# Altium project MotorDriverWithCurrent_Project.PrjPcb
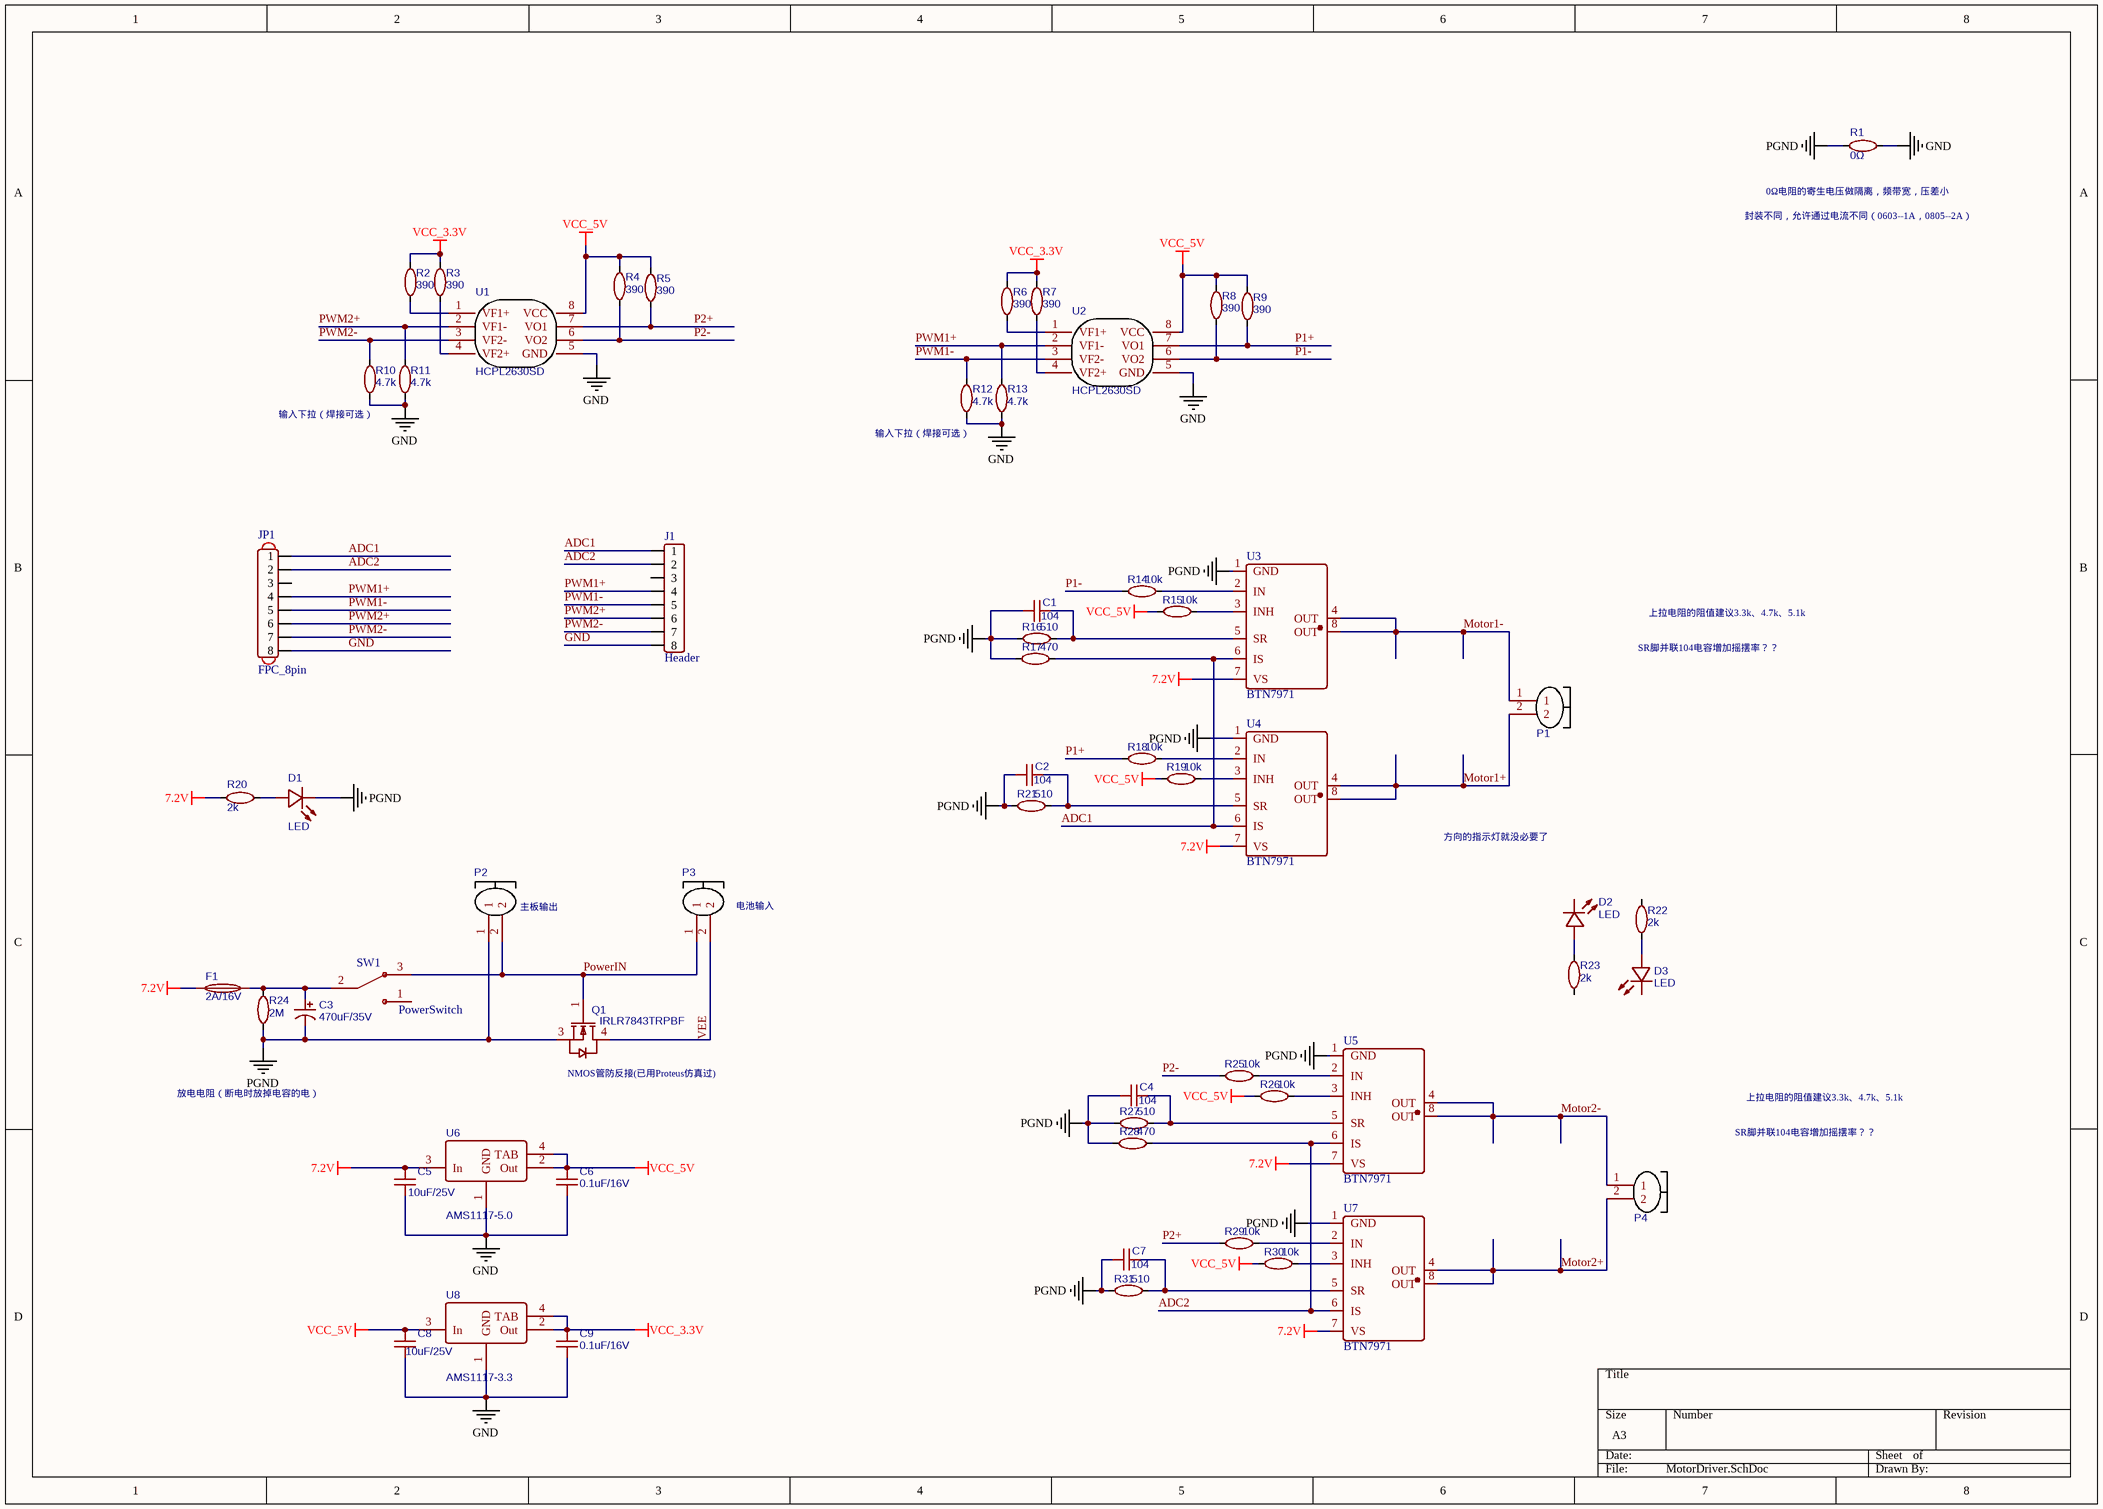
[diagram p0: MotorDriver.SchDoc]
1 sheet, 60 parts. Net scope: global (net labels, ports and power ports of the same name join across sheets).
Board file: MotorDriver.PcbDoc

## Sheet MotorDriver.SchDoc
size A3

### Parts
C1  104  [CAP_0603]
C2  104  [CAP_0603]
C3  470uF/35V  [CAPE_TH_3.5_8]
C4  104  [CAP_0603]
C5  10uF/25V  [CAP_0603]
C6  0.1uF/16V  [CAP_0603]
C7  104  [CAP_0603]
C8  10uF/25V  [CAP_0603]
C9  0.1uF/16V  [CAP_0603]
D1  LED  [LED_0603_B]
D2  LED  [LED_0603_B]
D3  LED  [LED_0603_B]
F1  2A/16V  [F1206]
J1  Header  [Header 2.54X8]
JP1  FPC_8pin  [FPC_1.0_8P]
P1  KF-2P-5.08  [KF_2P-5.08]  (value not drawn)
P2  KF-2P-5.08  [KF_2P-5.08]  (value not drawn)
P3  KF-2P-5.08  [KF_2P-5.08]  (value not drawn)
P4  KF-2P-5.08  [KF_2P-5.08]  (value not drawn)
Q1  IRLR7843TRPBF  [TO-252-2]
R1  0Ω  [RES_0805]
R2  390  [RES_0603]
R3  390  [RES_0603]
R4  390  [RES_0603]
R5  390  [RES_0603]
R6  390  [RES_0603]
R7  390  [RES_0603]
R8  390  [RES_0603]
R9  390  [RES_0603]
R10  4.7k  [RES_0603]
R11  4.7k  [RES_0603]
R12  4.7k  [RES_0603]
R13  4.7k  [RES_0603]
R14  10k  [RES_0603]
R15  10k  [RES_0603]
R16  510  [RES_0603]
R17  470  [RES_0603]
R18  10k  [RES_0603]
R19  10k  [RES_0603]
R20  2k  [RES_0603]
R21  510  [RES_0603]
R22  2k  [RES_0603]
R23  2k  [RES_0603]
R24  2M  [RES_0805]
R25  10k  [RES_0603]
R26  10k  [RES_0603]
R27  510  [RES_0603]
R28  470  [RES_0603]
R29  10k  [RES_0603]
R30  10k  [RES_0603]
R31  510  [RES_0603]
SW1  PowerSwitch  [SW-TH_K3-1260D-K1]
U1  HCPL2630SD  [SOP8_2_54]
U2  HCPL2630SD  [SOP8_2_54]
U3  BTN7971  [TO263_7]
U4  BTN7971  [TO263_7]
U5  BTN7971  [TO263_7]
U6  AMS1117-5.0  [SOT-223_3]
U7  BTN7971  [TO263_7]
U8  AMS1117-3.3  [SOT-223_3]

### Nets
7.2V: C5.1 F1.1 R20.1 U3.7(VS) U4.7(VS) U5.7(VS) U6.3(In) U7.7(VS)
GND: C5.2 C6.2 C8.2 C9.2 J1.8 JP1.8 R1.1 R10.1 R11.1 R12.1 R13.1 U1.5(GND) U2.5(GND) U6.1(GND) U8.1(GND)
PGND: C1.1 C2.1 C3.2 C4.1 C7.1 D1.C P2.1 Q1.3(S) R1.2 R16.2 R17.1 R21.2 R24.1 R27.2 R28.1 R31.2 U3.1(GND) U4.1(GND) U5.1(GND) U7.1(GND)
VCC_3.3V: C9.1 R2.2 R3.2 R6.2 R7.2 U8.2(Out) U8.4(TAB)
VCC_5V: C6.1 C8.1 R4.2 R5.2 R8.2 R9.2 R15.2 R19.2 R26.2 R30.2 U1.8(VCC) U2.8(VCC) U6.2(Out) U6.4(TAB) U8.3(In)
ADC1: J1.1 JP1.1 R17.2 U3.6(IS) U4.6(IS)
ADC2: J1.2 JP1.2 R28.2 U5.6(IS) U7.6(IS)
Motor1+: P1.2 U4.4(OUT) U4.8(OUT)
Motor1-: P1.1 U3.4(OUT) U3.8(OUT)
Motor2+: P4.2 U7.4(OUT) U7.8(OUT)
Motor2-: P4.1 U5.4(OUT) U5.8(OUT)
P1+: R9.1 R18.2 U2.7(VO1)
P1-: R8.1 R14.2 U2.6(VO2)
P2+: R5.1 R29.2 U1.7(VO1)
P2-: R4.1 R25.2 U1.6(VO2)
PowerIN: P2.2 P3.1 Q1.1(G) SW1.3(NC)
PWM1+: J1.4 JP1.4 R13.2 U2.2(VF1-)
PWM1-: J1.5 JP1.5 R12.2 U2.3(VF2-)
PWM2+: J1.6 JP1.6 R11.2 U1.2(VF1-)
PWM2-: J1.7 JP1.7 R10.2 U1.3(VF2-)
VEE: P3.2 Q1.4(D)
NetC1_2: C1.2 R16.1 U3.5(SR)
NetC2_2: C2.2 R21.1 U4.5(SR)
NetC3_1: C3.1 F1.2 R24.2 SW1.2(C)
NetC4_2: C4.2 R27.1 U5.5(SR)
NetC7_2: C7.2 R31.1 U7.5(SR)
NetD1_A: D1.A R20.2
NetD2_A: D2.A R23.2
NetD3_A: D3.A R22.2
NetR2_1: R2.1 U1.1(VF1+)
NetR3_1: R3.1 U1.4(VF2+)
NetR6_1: R6.1 U2.1(VF1+)
NetR7_1: R7.1 U2.4(VF2+)
NetR14_1: R14.1 U3.2(IN)
NetR15_1: R15.1 U3.3(INH)
NetR18_1: R18.1 U4.2(IN)
NetR19_1: R19.1 U4.3(INH)
NetR25_1: R25.1 U5.2(IN)
NetR26_1: R26.1 U5.3(INH)
NetR29_1: R29.1 U7.2(IN)
NetR30_1: R30.1 U7.3(INH)

Not connected (* = marked no-connect by the designer): D2 C; D3 C; J1 3; JP1 3; R22 1; R23 1; SW1 1(ON)

### Notes on the sheet
- 封装不同，允许通过电流不同（0603--1A，0805--2A）
- (near R1) 0Ω电阻的寄生电压做隔离，频带宽，压差小
- (near R10) 输入下拉（焊接可选）
- (near R12) 输入下拉（焊接可选）
- SR脚并联104电容增加摇摆率？？
- 上拉电阻的阻值建议3.3k、4.7k、5.1k
- 方向的指示灯就没必要了
- (near P2) 主板输出
- (near P3) 电池输入
- 放电电阻（断电时放掉电容的电）
- (near Q1) NMOS管防反接(已用Proteus仿真过)

### Library data of the parts
C1 C2 C4-C9 = CAP_0603: BOM_Manufacturer: Samsung Electro-Mechanics; BOM_Manufacturer Part: CL10B104KB8WPNC; nameAlias: Capacitance; Contributor: LCSC; BOM_Supplier: LCSC; BOM_Supplier Part: C307348; spicePre: C; spiceSymbolName: CL10B104KB8WPNC
C3 = CAP_E_DIP: 直插电解电容; BOM_Manufacturer: ROQANG; BOM_Manufacturer Part: RVT1C221M0607; nameAlias: Capacitance; BOM_Supplier: LCSC; BOM_Supplier Part: C72496; spicePre: C; spiceSymbolName: RVT1C221M0607
D1-D3 = LED_0603: 发光LED; BOM_Manufacturer: ARKLED; BOM_Manufacturer Part: D-G080508G1; Contributor: LCSC; BOM_Supplier: LCSC; BOM_Supplier Part: C107402; spicePre: L; spiceSymbolName: D-G080508G1
F1 = JK-NSMD100-16V: BOM_Manufacturer: Jinrui Electronic Materials Co.; Contributor: LCSC; BOM_Supplier: LCSC; BOM_Supplier Part: C369161; BOM_Manufacturer Part: JK-NSMD100-16V; spicePre: F; spiceSymbolName: JK-NSMD100-16V
J1 = Header 2.54_8
P1-P4 = KF-2P-5.08: 端子2P; BOM_Manufacturer: ReliaPro; BOM_Manufacturer Part: WJ500H-5.08-2P; BOM_Supplier: LCSC; image: //image.lceda.cn/szlcsc/C8478.jpg; BOM_Supplier Part: C8478; spicePre: P; spiceSymbolName: WJ500H-5.08-2P
Q1 = IRLR7843TRPBF: MOS管; BOM_Manufacturer: IR; SMT Type: Extend; BOM_Supplier: LCSC; BOM_Manufacturer Part: IRLR7843TRPBF; image: //image.lceda.cn/szlcsc/C21988.jpg; BOM_Supplier Part: C21988; BOM_LCSC Assembly: Yes; spicePre: Q; spiceSymbolName: IRLR7843TRPBF
R1 R24 = RES_0805: BOM_Manufacturer: YAGEO; BOM_Manufacturer Part: RC0402JR-07100KL; nameAlias: Resistance (Ohms); BOM_Supplier: LCSC; BOM_Supplier Part: C106234; spicePre: R; spiceSymbolName: RC0402JR-07100KL
R2-R23 R25-R31 = RES_0603: BOM_Manufacturer: YAGEO; BOM_Manufacturer Part: RC0402JR-07100KL; nameAlias: Resistance (Ohms); BOM_Supplier: LCSC; BOM_Supplier Part: C106234; spicePre: R; spiceSymbolName: RC0402JR-07100KL
U1 U2 = HCPL2630SD: BOM_Manufacturer: FAIRCHILD; BOM_Supplier: LCSC; BOM_Manufacturer Part: HCPL2630SD; image: //image.lceda.cn/szlcsc/C46037.jpg; BOM_Supplier Part: C46037; spicePre: U; spiceSymbolName: HCPL2630SD
U6 = AMS1117-5.0: BOM_Manufacturer: SK; BOM_Manufacturer Part: AMS1117-3.3; Contributor: LCSC; SMT Type: Extend; BOM_Supplier: LCSC; BOM_Supplier Part: C165482; BOM_LCSC Assembly: Yes; spicePre: U; spiceSymbolName: AMS1117-3.3_C165482
U8 = AMS1117-3.3: BOM_Manufacturer: SK; Contributor: LCSC; SMT Type: Extend; BOM_Supplier: LCSC; BOM_Supplier Part: C165482; BOM_Manufacturer Part: AMS1117-3.3; BOM_LCSC Assembly: Yes; spicePre: U; spiceSymbolName: AMS1117-3.3_C165482